# Altium schematic sheet interface.SchDoc
size A4; SheetNumber: 5; SheetTotal: 5
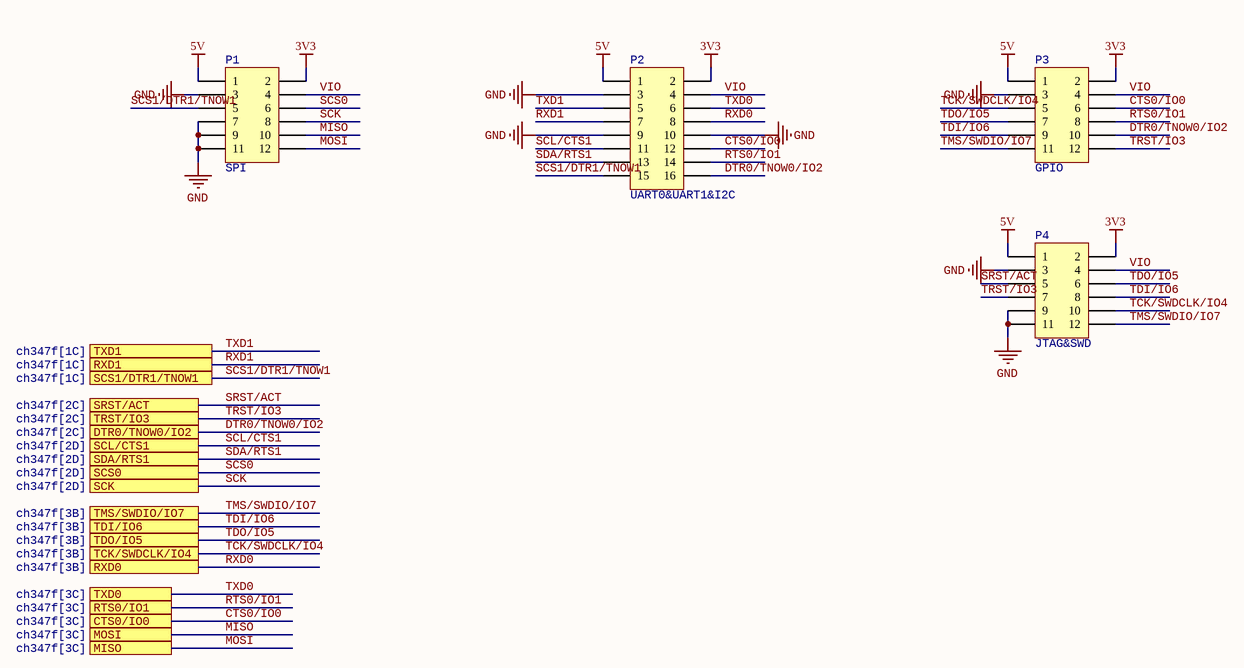
[diagram p0: interface.SchDoc]

## Parts
P1  SPI  [HDR2X6]
P2  UART0&UART1&I2C  [HDR2X8]
P3  GPIO  [HDR2X6]
P4  JTAG&SWD  [HDR2X6]

## Ports
CTS0/IO0 (see ch347f[3C]), DTR0/TNOW0/IO2 (see ch347f[2C]), MISO (see ch347f[3C]), MOSI (see ch347f[3C]), RTS0/IO1 (see ch347f[3C]), RXD0 (see ch347f[3B]), RXD1 (see ch347f[1C]), SCK (see ch347f[2D]), SCL/CTS1 (see ch347f[2D]), SCS0 (see ch347f[2D]), SCS1/DTR1/TNOW1 (see ch347f[1C]), SDA/RTS1 (see ch347f[2D]), SRST/ACT (see ch347f[2C]), TCK/SWDCLK/IO4 (see ch347f[3B]), TDI/IO6 (see ch347f[3B]), TDO/IO5 (see ch347f[3B]), TMS/SWDIO/IO7 (see ch347f[3B]), TRST/IO3 (see ch347f[2C]), TXD0 (see ch347f[3C]), TXD1 (see ch347f[1C])

## Nets
3V3: P1.2 P2.2 P3.2 P4.2
5V: P1.1 P2.1 P3.1 P4.1
GND: P1.3 P1.7 P1.9 P1.11 P2.3 P2.9 P2.10 P3.3 P4.3 P4.9 P4.11
CTS0/IO0: P2.12 P3.6 ; port CTS0/IO0
DTR0/TNOW0/IO2: P2.16 P3.10 ; port DTR0/TNOW0/IO2
MISO: P1.10 ; port MOSI
MOSI: P1.12 ; port MISO
RTS0/IO1: P2.14 P3.8 ; port RTS0/IO1
RXD0: P2.8 ; port RXD0
RXD1: P2.7 ; port RXD1
SCK: P1.8 ; port SCK
SCL/CTS1: P2.11 ; port SCL/CTS1
SCS0: P1.6 ; port SCS0
SCS1/DTR1/TNOW1: P1.5 P2.15 ; port SCS1/DTR1/TNOW1
SDA/RTS1: P2.13 ; port SDA/RTS1
SRST/ACT: P4.5 ; port SRST/ACT
TCK/SWDCLK/IO4: P3.5 P4.10 ; port TCK/SWDCLK/IO4
TDI/IO6: P3.9 P4.8 ; port TDI/IO6
TDO/IO5: P3.7 P4.6 ; port TDO/IO5
TMS/SWDIO/IO7: P3.11 P4.12 ; port TMS/SWDIO/IO7
TRST/IO3: P3.12 P4.7 ; port TRST/IO3
TXD0: P2.6 ; port TXD0
TXD1: P2.5 ; port TXD1
VIO: P1.4 P2.4 P3.4 P4.4

## Library data of the parts
P1 P3 P4 = Header 6X2: Header, 6-Pin, Dual row; LatestRevisionDate: 17-Jul-2002; LatestRevisionNote: Re-released for DXP Platform.; Publisher: Altium Limited
P2 = Header 8X2: Header, 8-Pin, Dual row; LatestRevisionDate: 17-Jul-2002; LatestRevisionNote: Re-released for DXP Platform.; Publisher: Altium Limited